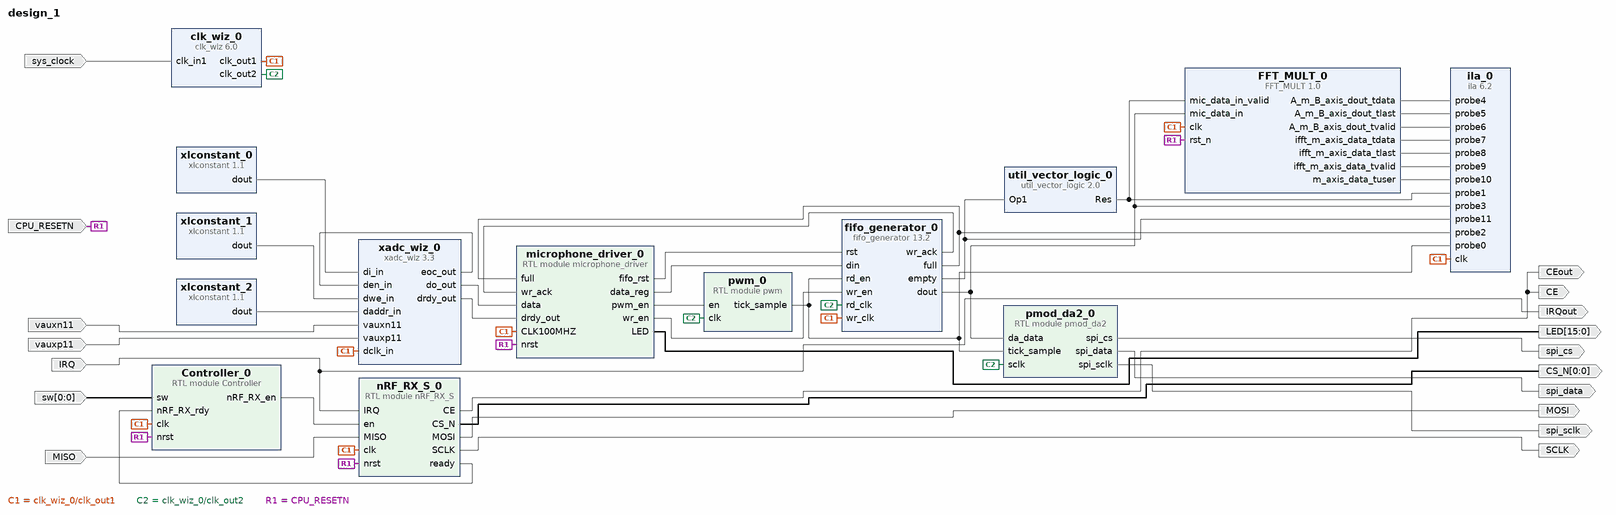
[diagram p0: block diagram of the top level]
# Vivado block design design_1, xc7a100tcsg324-1, Vivado 2022.1
create_bd_design design_1

create_bd_port -dir I -type clk sys_clock
set_property -dict {CONFIG.FREQ_HZ 100000000 CONFIG.PHASE 0.0} [get_bd_ports sys_clock]
create_bd_port -dir I -type rst CPU_RESETN
set_property -dict {CONFIG.POLARITY ACTIVE_LOW} [get_bd_ports CPU_RESETN]
create_bd_port -dir I -from 0 -to 0 sw
create_bd_port -dir O CE
create_bd_port -dir O -from 0 -to 0 CS_N
create_bd_port -dir I -type intr IRQ
create_bd_port -dir I MISO
create_bd_port -dir O MOSI
create_bd_port -dir O SCLK
create_bd_port -dir O IRQout
create_bd_port -dir O CEout
create_bd_port -dir I vauxp11
create_bd_port -dir I vauxn11
create_bd_port -dir O -from 15 -to 0 LED
create_bd_port -dir O spi_data
create_bd_port -dir O spi_sclk
create_bd_port -dir O spi_cs

create_bd_cell -type module -reference Controller Controller_0
create_bd_cell -type ip -vlnv user.org:user:FFT_MULT:1.0 FFT_MULT_0
create_bd_cell -type ip -vlnv xilinx.com:ip:clk_wiz:6.0 clk_wiz_0
set_property -dict [list \
  CONFIG.CLKOUT2_JITTER 183.243 \
  CONFIG.CLKOUT2_PHASE_ERROR 98.575 \
  CONFIG.CLKOUT2_REQUESTED_OUT_FREQ 20.000 \
  CONFIG.CLKOUT2_USED true \
  CONFIG.CLK_IN1_BOARD_INTERFACE sys_clock \
  CONFIG.MMCM_CLKOUT1_DIVIDE 50 \
  CONFIG.NUM_OUT_CLKS 2 \
  CONFIG.USE_BOARD_FLOW true \
  CONFIG.USE_LOCKED false \
  CONFIG.USE_RESET false \
] [get_bd_cells clk_wiz_0]
create_bd_cell -type ip -vlnv xilinx.com:ip:fifo_generator:13.2 fifo_generator_0
set_property -dict [list \
  CONFIG.Fifo_Implementation Independent_Clocks_Builtin_FIFO \
  CONFIG.Input_Data_Width 12 \
  CONFIG.Input_Depth 4096 \
  CONFIG.Performance_Options First_Word_Fall_Through \
  CONFIG.Read_Clock_Frequency 100 \
  CONFIG.Valid_Flag false \
  CONFIG.Write_Acknowledge_Flag true \
  CONFIG.Write_Clock_Frequency 20 \
] [get_bd_cells fifo_generator_0]
create_bd_cell -type ip -vlnv xilinx.com:ip:ila:6.2 ila_0
set_property -dict [list \
  CONFIG.C_DATA_DEPTH 65536 \
  CONFIG.C_ENABLE_ILA_AXI_MON false \
  CONFIG.C_MONITOR_TYPE Native \
  CONFIG.C_NUM_OF_PROBES 12 \
  CONFIG.C_PROBE10_TYPE 1 \
  CONFIG.C_PROBE10_WIDTH 16 \
  CONFIG.C_PROBE3_TYPE 1 \
  CONFIG.C_PROBE3_WIDTH 12 \
  CONFIG.C_PROBE4_TYPE 1 \
  CONFIG.C_PROBE4_WIDTH 80 \
  CONFIG.C_PROBE7_TYPE 1 \
  CONFIG.C_PROBE7_WIDTH 80 \
] [get_bd_cells ila_0]
create_bd_cell -type module -reference microphone_driver microphone_driver_0
create_bd_cell -type module -reference nRF_RX_S nRF_RX_S_0
create_bd_cell -type module -reference pmod_da2 pmod_da2_0
create_bd_cell -type ip -vlnv xilinx.com:ip:xadc_wiz:3.3 xadc_wiz_0
set_property -dict [list \
  CONFIG.ADC_CONVERSION_RATE 200 \
  CONFIG.ADC_OFFSET_AND_GAIN_CALIBRATION false \
  CONFIG.CHANNEL_ENABLE_VAUXP11_VAUXN11 true \
  CONFIG.CHANNEL_ENABLE_VAUXP6_VAUXN6 false \
  CONFIG.CHANNEL_ENABLE_VP_VN false \
  CONFIG.ENABLE_CALIBRATION_AVERAGING false \
  CONFIG.ENABLE_RESET false \
  CONFIG.EXTERNAL_MUX_CHANNEL VP_VN \
  CONFIG.INTERFACE_SELECTION ENABLE_DRP \
  CONFIG.OT_ALARM false \
  CONFIG.SENSOR_OFFSET_AND_GAIN_CALIBRATION false \
  CONFIG.SEQUENCER_MODE Continuous \
  CONFIG.SINGLE_CHANNEL_SELECTION TEMPERATURE \
  CONFIG.USER_TEMP_ALARM false \
  CONFIG.VCCAUX_ALARM false \
  CONFIG.VCCINT_ALARM false \
  CONFIG.XADC_STARUP_SELECTION channel_sequencer \
] [get_bd_cells xadc_wiz_0]
create_bd_cell -type ip -vlnv xilinx.com:ip:xlconstant:1.1 xlconstant_0
set_property -dict {CONFIG.CONST_VAL 0 CONFIG.CONST_WIDTH 16} [get_bd_cells xlconstant_0]
create_bd_cell -type ip -vlnv xilinx.com:ip:xlconstant:1.1 xlconstant_1
set_property -dict {CONFIG.CONST_VAL 0} [get_bd_cells xlconstant_1]
create_bd_cell -type ip -vlnv xilinx.com:ip:xlconstant:1.1 xlconstant_2
set_property -dict {CONFIG.CONST_VAL 0x1B CONFIG.CONST_WIDTH 7} [get_bd_cells xlconstant_2]
create_bd_cell -type module -reference pwm pwm_0
create_bd_cell -type ip -vlnv xilinx.com:ip:util_vector_logic:2.0 util_vector_logic_0
set_property -dict {CONFIG.C_OPERATION not CONFIG.C_SIZE 1} [get_bd_cells util_vector_logic_0]

# ---- connections ----

connect_bd_net -net Controller_0_FIFO_rst [get_bd_pins microphone_driver_0/fifo_rst] [get_bd_pins fifo_generator_0/rst]
connect_bd_net [get_bd_pins Controller_0/nRF_RX_en] [get_bd_pins nRF_RX_S_0/en]
connect_bd_net [get_bd_pins FFT_MULT_0/A_m_B_axis_dout_tdata] [get_bd_pins ila_0/probe4]
connect_bd_net [get_bd_pins FFT_MULT_0/A_m_B_axis_dout_tlast] [get_bd_pins ila_0/probe5]
connect_bd_net [get_bd_pins FFT_MULT_0/A_m_B_axis_dout_tvalid] [get_bd_pins ila_0/probe6]
connect_bd_net [get_bd_pins FFT_MULT_0/ifft_m_axis_data_tdata] [get_bd_pins ila_0/probe7]
connect_bd_net [get_bd_pins FFT_MULT_0/ifft_m_axis_data_tlast] [get_bd_pins ila_0/probe8]
connect_bd_net [get_bd_pins FFT_MULT_0/ifft_m_axis_data_tvalid] [get_bd_pins ila_0/probe9]
connect_bd_net [get_bd_pins FFT_MULT_0/m_axis_data_tuser] [get_bd_pins ila_0/probe10]
connect_bd_net -net IRQ_0_1 [get_bd_ports IRQ] [get_bd_ports IRQout] [get_bd_pins nRF_RX_S_0/IRQ]
connect_bd_net -net MISO_0_1 [get_bd_ports MISO] [get_bd_pins nRF_RX_S_0/MISO]
connect_bd_net [get_bd_pins clk_wiz_0/clk_out1] \
  [get_bd_pins Controller_0/clk] [get_bd_pins FFT_MULT_0/clk] [get_bd_pins fifo_generator_0/wr_clk] [get_bd_pins ila_0/clk] \
  [get_bd_pins microphone_driver_0/CLK100MHZ] [get_bd_pins nRF_RX_S_0/clk] [get_bd_pins xadc_wiz_0/dclk_in]
connect_bd_net [get_bd_pins clk_wiz_0/clk_out2] [get_bd_pins fifo_generator_0/rd_clk] [get_bd_pins pmod_da2_0/sclk] [get_bd_pins pwm_0/clk]
connect_bd_net [get_bd_pins fifo_generator_0/dout] [get_bd_pins FFT_MULT_0/mic_data_in] [get_bd_pins ila_0/probe3] [get_bd_pins pmod_da2_0/da_data]
connect_bd_net [get_bd_pins fifo_generator_0/empty] [get_bd_pins ila_0/probe11] [get_bd_pins util_vector_logic_0/Op1]
connect_bd_net [get_bd_pins fifo_generator_0/full] [get_bd_pins ila_0/probe2] [get_bd_pins microphone_driver_0/full]
connect_bd_net -net fifo_generator_0_valid [get_bd_pins util_vector_logic_0/Res] [get_bd_pins FFT_MULT_0/mic_data_in_valid] [get_bd_pins ila_0/probe1]
connect_bd_net [get_bd_pins fifo_generator_0/wr_ack] [get_bd_pins microphone_driver_0/wr_ack]
connect_bd_net [get_bd_pins microphone_driver_0/LED] [get_bd_ports LED]
connect_bd_net [get_bd_pins microphone_driver_0/data_reg] [get_bd_pins fifo_generator_0/din]
connect_bd_net -net microphone_driver_0_fifo_wr [get_bd_pins microphone_driver_0/wr_en] [get_bd_pins fifo_generator_0/wr_en]
connect_bd_net [get_bd_pins microphone_driver_0/pwm_en] [get_bd_pins pwm_0/en]
connect_bd_net [get_bd_pins nRF_RX_S_0/CE] [get_bd_ports CE] [get_bd_ports CEout]
connect_bd_net [get_bd_pins nRF_RX_S_0/CS_N] [get_bd_ports CS_N]
connect_bd_net [get_bd_pins nRF_RX_S_0/MOSI] [get_bd_ports MOSI]
connect_bd_net [get_bd_pins nRF_RX_S_0/SCLK] [get_bd_ports SCLK]
connect_bd_net [get_bd_pins nRF_RX_S_0/ready] [get_bd_pins Controller_0/nRF_RX_rdy]
connect_bd_net [get_bd_pins pmod_da2_0/spi_cs] [get_bd_ports spi_cs]
connect_bd_net [get_bd_pins pmod_da2_0/spi_data] [get_bd_ports spi_data]
connect_bd_net [get_bd_pins pmod_da2_0/spi_sclk] [get_bd_ports spi_sclk]
connect_bd_net [get_bd_pins pwm_0/tick_sample] [get_bd_pins fifo_generator_0/rd_en] [get_bd_pins ila_0/probe0] [get_bd_pins pmod_da2_0/tick_sample]
connect_bd_net [get_bd_ports sw] [get_bd_pins Controller_0/sw]
connect_bd_net [get_bd_ports sys_clock] [get_bd_pins clk_wiz_0/clk_in1]
connect_bd_net -net util_vector_logic_0_Res [get_bd_ports CPU_RESETN] \
  [get_bd_pins Controller_0/nrst] [get_bd_pins FFT_MULT_0/rst_n] [get_bd_pins microphone_driver_0/nrst] \
  [get_bd_pins nRF_RX_S_0/nrst]
connect_bd_net -net vauxn11_1 [get_bd_ports vauxn11] [get_bd_pins xadc_wiz_0/vauxn11]
connect_bd_net -net vauxp11_1 [get_bd_ports vauxp11] [get_bd_pins xadc_wiz_0/vauxp11]
connect_bd_net [get_bd_pins xadc_wiz_0/do_out] [get_bd_pins microphone_driver_0/data]
connect_bd_net [get_bd_pins xadc_wiz_0/drdy_out] [get_bd_pins microphone_driver_0/drdy_out]
connect_bd_net [get_bd_pins xadc_wiz_0/eoc_out] [get_bd_pins xadc_wiz_0/den_in]
connect_bd_net [get_bd_pins xlconstant_0/dout] [get_bd_pins xadc_wiz_0/di_in]
connect_bd_net [get_bd_pins xlconstant_1/dout] [get_bd_pins xadc_wiz_0/dwe_in]
connect_bd_net [get_bd_pins xlconstant_2/dout] [get_bd_pins xadc_wiz_0/daddr_in]

validate_bd_design
save_bd_design
